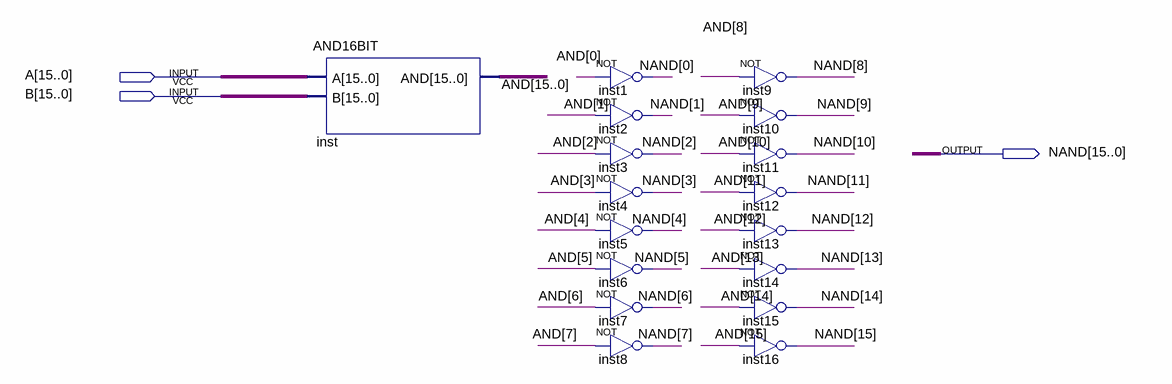
[diagram p0: schematic sheet]
// Quartus schematic NAND_16bit.bdf as structural Verilog: 17 symbols, 3 pins
module NAND_16bit (
  input  [15:0] A,
  input  [15:0] B,
  output [15:0] NAND
);

  wire [15:0] AND;

  AND16BIT inst (.A(A), .B(B), .AND(AND));
  not inst1 (NAND[0], AND[0]);
  not inst2 (NAND[1], AND[1]);
  not inst3 (NAND[2], AND[2]);
  not inst4 (NAND[3], AND[3]);
  not inst5 (NAND[4], AND[4]);
  not inst6 (NAND[5], AND[5]);
  not inst7 (NAND[6], AND[6]);
  not inst8 (NAND[7], AND[7]);
  not inst9 (NAND[8], AND[8]);
  not inst10 (NAND[9], AND[9]);
  not inst11 (NAND[10], AND[10]);
  not inst12 (NAND[11], AND[11]);
  not inst13 (NAND[12], AND[12]);
  not inst14 (NAND[13], AND[13]);
  not inst15 (NAND[14], AND[14]);
  not inst16 (NAND[15], AND[15]);
endmodule
